# Altium schematic sheet 03_UART_232.SchDoc
size A4
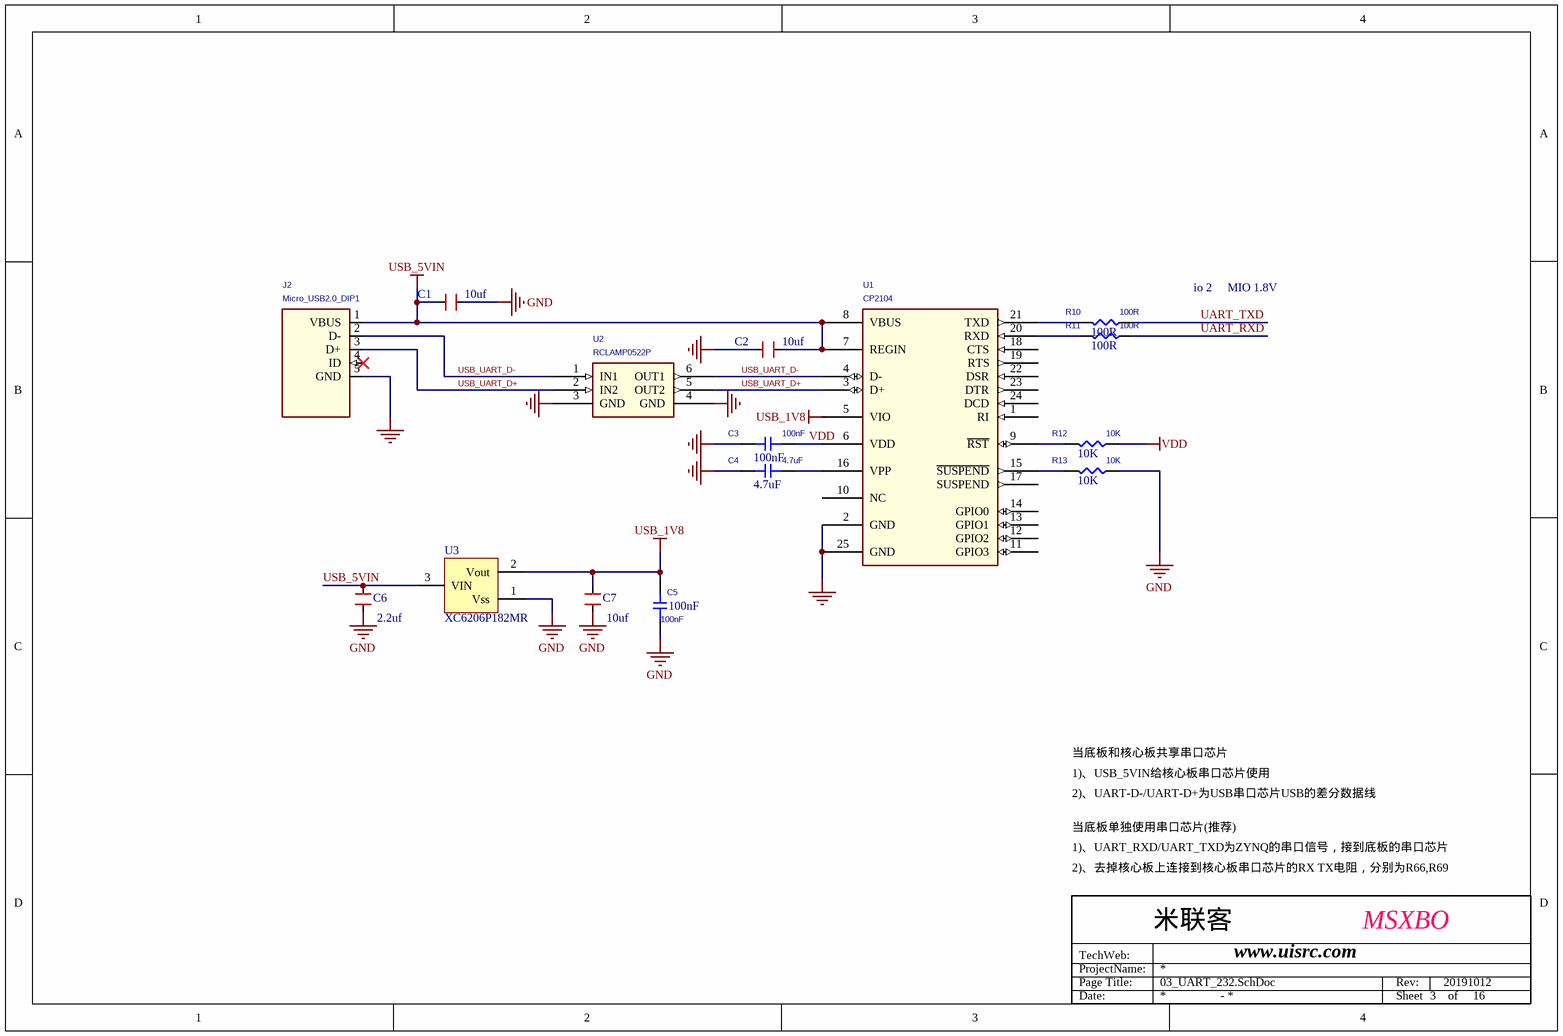
[diagram p0: 03_UART_232.SchDoc]

## Parts
C1  10uf  [CAP0603]
C2  10uf  [CAP0603]
C3  100nF  [C0603]
C4  4.7uF  [C0603]
C5  100nF  [C0603]
C6  2.2uf  [CAP0603]
C7  10uf  [CAP0603]
J2  Micro_USB2.0_DIP1  [MicroUsb]
R10  100R  [R0603]
R11  100R  [R0603]
R12  10K  [R0603]
R13  10K  [R0603]
U1  CP2104  [QFN24_50P4X4X1]
U2  RCLAMP0522P  [SLP1610P4_6]
U3  XC6206P182MR  [SOT23]

## Nets
GND: C1.1 C2.2 C3.1 C4.1 C5.1 C6.1 C7.1 J2.5(GND) R13.2 U1.2(GND) U1.25(GND) U2.3(GND) U2.4(GND) U3.1(Vss)
USB_1V8: C5.2 C7.2 U1.5(VIO) U3.2(Vout)
USB_5VIN: C1.2 C2.1 C6.2 J2.1(VBUS) U1.7(REGIN) U1.8(VBUS) U3.3(VIN)
VDD: C3.2 R12.2 U1.6(VDD)
UART_RXD: R11.2
UART_TXD: R10.2
USB_UART_D+: J2.3(D+) U1.3(D+) U2.2(IN2) U2.5(OUT2)
USB_UART_D-: J2.2(D-) U1.4(D-) U2.1(IN1) U2.6(OUT1)
NetC4_2: C4.2 U1.16(VPP)
NetR10_1: R10.1 U1.21(TXD)
NetR11_1: R11.1 U1.20(RXD)
NetR12_1: R12.1 U1.9(~{RST})
NetR13_1: R13.1 U1.15(~{SUSPEND})

Not connected (* = marked no-connect by the designer): J2 4(ID)*; U1 1(RI) 10(NC) 11(GPIO3) 12(GPIO2) 13(GPIO1) 14(GPIO0) 17(SUSPEND) 18(CTS) 19(RTS) 22(DSR) 23(DTR) 24(DCD)

## Notes on the sheet
- io 2
- MIO 1.8V
- 当底板和核心板共享串口芯片
- 1)、USB_5VIN给核心板串口芯片使用
- 2)、UART-D-/UART-D+为USB串口芯片USB的差分数据线
- 当底板单独使用串口芯片(推荐)
- 1)、UART_RXD/UART_TXD为ZYNQ的串口信号，接到底板的串口芯片
- 2)、去掉核心板上连接到核心板串口芯片的RX TX电阻，分别为R66,R69
- ProjectName:
- TechWeb:
- Page Title:
- 米联客
- www.uisrc.com
- MSXBO
- Rev:
- 20191012
- Date:
- -
- Sheet
- 3    of     16

## Library data of the parts
C1 C2 C6 C7 = CAPACITOR: Generic Capacitor; DPN: *; Manufacturer: *
C3-C5 = CAP1: VC2: 0; MAX_TEMP: CTMAX; SLOPE: CSMAX; KNEE: CBMAX; CURRENT: CIMAX; VOLTAGE: CMAX; PSpiceTemplate: C^@REFDES %1 %2 ?TOLERANCE|C^@REFDES| @VALUE ?IC/IC=@IC/ TC=@TC1,@TC2 ?TOLERANCE|\n.model C^@REFDES CAP C=1 DEV=@TOLERANCE% TC1=@TC1 TC2=@TC2 VC1=@VC1 VC2=@VC2|; DIST: FLAT; VC1: 0; TC1: 0; TC2: 0
  C3 C5: Value: 100nF
  C4: Value: 4.7uF
J2 = Micro_USB2_0.0_DIP1
R10-R13 = RES1: DIST: FLAT; PSpiceTemplate: R^@REFDES %1 %2 ?TOLERANCE|R^@REFDES| @VALUE TC=@TC1,@TC2 ?TOLERANCE|\n.model R^@REFDES RES R=1 DEV=@TOLERANCE% TC1=@TC1 TC2=@TC2|; VOLTAGE: RVMAX; SLOPE: RSMAX; MAX_TEMP: RTMAX; POWER: RMAX; TC1: 0; TC2: 0
  R10 R11: Value: 100R
  R12 R13: Value: 10K
U3 = XC6206P332MR